# Altium schematic sheet CAN_5V.SchDoc
size A; Organization: Cal Poly Racing; engineer1: who?
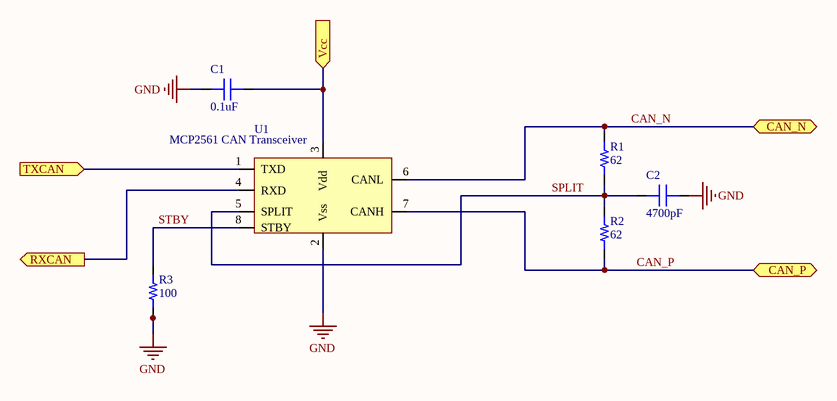
[diagram p0: CAN_5V.SchDoc]

## Parts
C1  capacitance: 0.1uF  [0603]  (hidden comment: capacitor)
C2  capacitance: 4700pF  [0603]  (hidden comment: capacitor)
R1  62  [RES 0603/1608]
R2  62  [RES 0603/1608]
R3  100  [RES 0603/1608]
U1  MCP2561 CAN Transceiver  [SOIC-8]

## Ports
CAN_N (bidir), CAN_P (bidir), RXCAN (out), TXCAN (in), Vcc (in)

## Nets
GND: C1.1 C2.2 R3.1 U1.2(Vss)
CAN_N: R1.2 U1.6(CANL) ; port CAN_N
CAN_P: R2.1 U1.7(CANH) ; port CAN_P
RXCAN: U1.4(RXD) ; port RXCAN
SPLIT: C2.1 R1.1 R2.2 U1.5(SPLIT)
STBY: R3.2 U1.8(STBY)
TXCAN: U1.1(TXD) ; port TXCAN
Vcc: C1.2 U1.3(Vdd) ; port Vcc

## Notes on the sheet
- Date:
- Time:
- File:

## Library data of the parts
C1 C2 = 1: Generic 0603 capacitor; id: 1; voltage: 50; dielectric: Ceramic; percent tolerance: 10; name: 0603 Capacitor; ESR: 1; package: 0603; quantity: 0
R1-R3 = 1: id: 1; name: 0603 Resistor; percent tolerance: 5; package: 0603; quantity: 0
  R1 R2: resistance: 62
  R3: resistance: 100
U1 = 5: id: 5; name: null; vcc: 0; type: CAN; package: SOIC-8; quantity: 0; link: https://www.digikey.com/product-detail/en/microchip-technology/MCP2561T-E-SN/MCP2561T-E-SNCT-ND/5148846